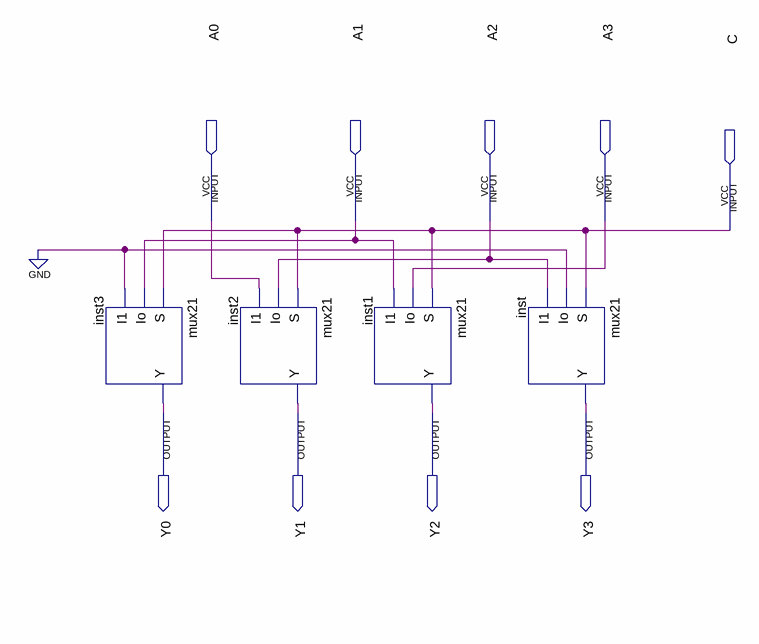
[diagram p0: schematic sheet]
// Quartus schematic LRshift.bdf as structural Verilog: 4 symbols, 9 pins
module LRshift (
  input  A0,
  input  A1,
  input  A2,
  input  A3,
  input  C,
  output Y0,
  output Y1,
  output Y2,
  output Y3
);

  mux21 inst3 (.S(C), .Io(A1), .I1(1'b0), .Y(Y0));
  mux21 inst2 (.S(C), .Io(A2), .I1(A0), .Y(Y1));
  mux21 inst1 (.S(C), .Io(A3), .I1(A1), .Y(Y2));
  mux21 inst (.S(C), .Io(1'b0), .I1(A2), .Y(Y3));
endmodule
